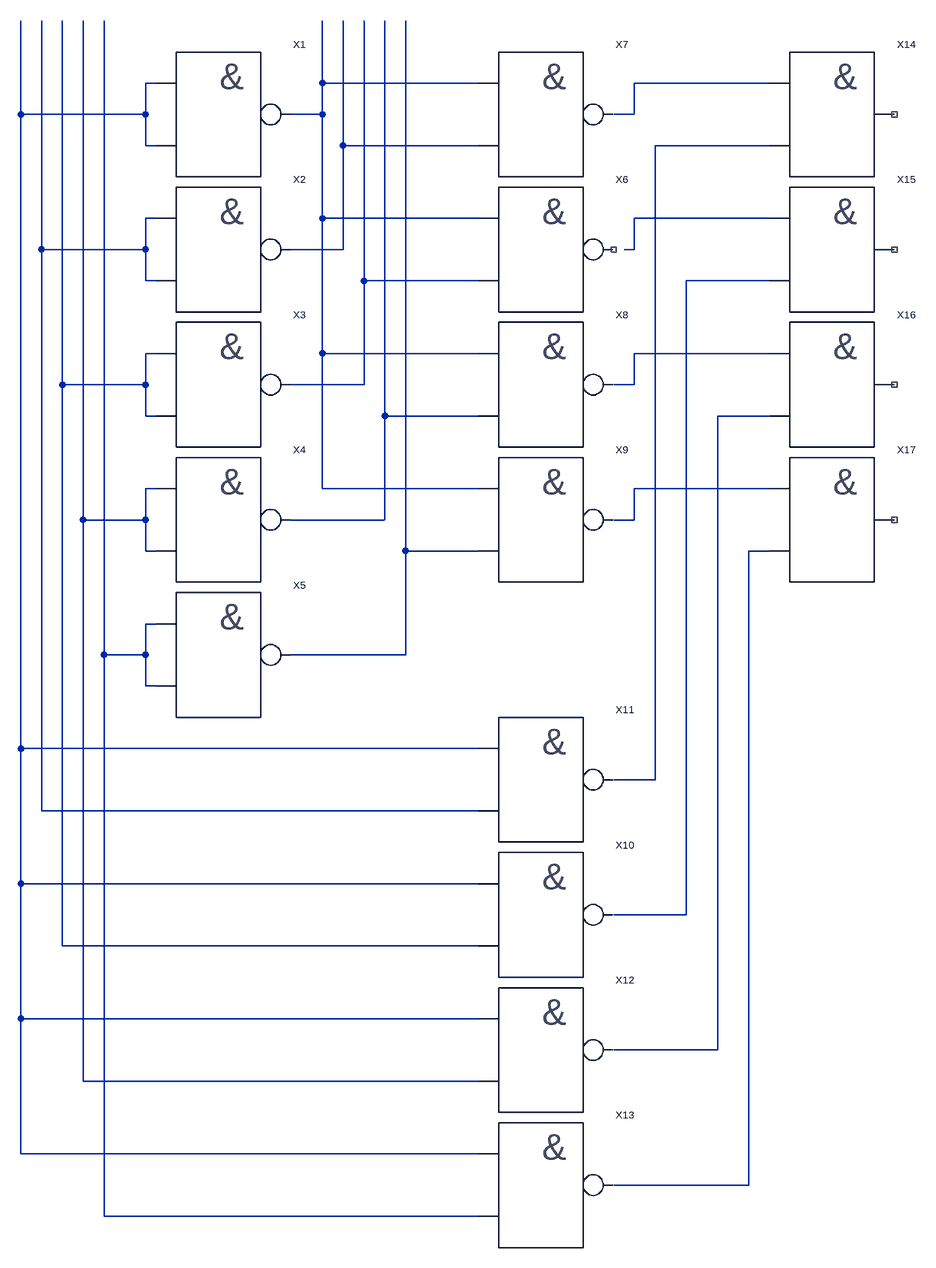
[diagram p0: schematic preobr.asc]
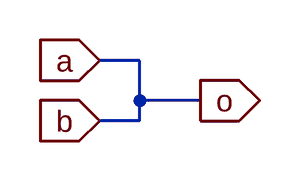
[diagram p1: sub-circuit and2.asc]
preobr.asc, the LTspice schematic file:
Version 4
SHEET 1 1400 1444
WIRE 256 -368 240 -368
WIRE 512 -368 512 -464
WIRE 752 -368 512 -368
WIRE 1200 -368 992 -368
WIRE 48 -320 48 -464
WIRE 240 -320 240 -368
WIRE 240 -320 48 -320
WIRE 512 -320 512 -368
WIRE 512 -320 464 -320
WIRE 992 -320 992 -368
WIRE 992 -320 960 -320
WIRE 240 -272 240 -320
WIRE 256 -272 240 -272
WIRE 544 -272 544 -464
WIRE 752 -272 544 -272
WIRE 1200 -272 1024 -272
WIRE 256 -160 240 -160
WIRE 512 -160 512 -320
WIRE 752 -160 512 -160
WIRE 1200 -160 992 -160
WIRE 80 -112 80 -464
WIRE 240 -112 240 -160
WIRE 240 -112 80 -112
WIRE 544 -112 544 -272
WIRE 544 -112 464 -112
WIRE 992 -112 992 -160
WIRE 992 -112 976 -112
WIRE 240 -64 240 -112
WIRE 256 -64 240 -64
WIRE 576 -64 576 -464
WIRE 752 -64 576 -64
WIRE 1200 -64 1072 -64
WIRE 256 48 240 48
WIRE 512 48 512 -160
WIRE 752 48 512 48
WIRE 1200 48 992 48
WIRE 112 96 112 -464
WIRE 240 96 240 48
WIRE 240 96 112 96
WIRE 576 96 576 -64
WIRE 576 96 464 96
WIRE 992 96 992 48
WIRE 992 96 960 96
WIRE 240 144 240 96
WIRE 256 144 240 144
WIRE 608 144 608 -464
WIRE 752 144 608 144
WIRE 1200 144 1120 144
WIRE 256 256 240 256
WIRE 512 256 512 48
WIRE 752 256 512 256
WIRE 1200 256 992 256
WIRE 144 304 144 -464
WIRE 240 304 240 256
WIRE 240 304 144 304
WIRE 608 304 608 144
WIRE 608 304 464 304
WIRE 992 304 992 256
WIRE 992 304 960 304
WIRE 240 352 240 304
WIRE 256 352 240 352
WIRE 640 352 640 -464
WIRE 752 352 640 352
WIRE 1200 352 1168 352
WIRE 256 464 240 464
WIRE 176 512 176 -464
WIRE 240 512 240 464
WIRE 240 512 176 512
WIRE 640 512 640 352
WIRE 640 512 464 512
WIRE 240 560 240 512
WIRE 256 560 240 560
WIRE 48 656 48 -320
WIRE 752 656 48 656
WIRE 1024 704 1024 -272
WIRE 1024 704 960 704
WIRE 80 752 80 -112
WIRE 752 752 80 752
WIRE 48 864 48 656
WIRE 752 864 48 864
WIRE 1072 912 1072 -64
WIRE 1072 912 960 912
WIRE 112 960 112 96
WIRE 752 960 112 960
WIRE 48 1072 48 864
WIRE 752 1072 48 1072
WIRE 1120 1120 1120 144
WIRE 1120 1120 960 1120
WIRE 144 1168 144 304
WIRE 752 1168 144 1168
WIRE 48 1280 48 1072
WIRE 752 1280 48 1280
WIRE 1168 1328 1168 352
WIRE 1168 1328 960 1328
WIRE 176 1376 176 512
WIRE 752 1376 176 1376
SYMBOL NAND2 352 -112 R0
SYMATTR InstName X2
SYMBOL NAND2 352 -320 R0
SYMATTR InstName X1
SYMBOL NAND2 352 96 R0
SYMATTR InstName X3
SYMBOL NAND2 352 304 R0
SYMATTR InstName X4
SYMBOL NAND2 352 512 R0
SYMATTR InstName X5
SYMBOL NAND2 848 -112 R0
SYMATTR InstName X6
SYMBOL NAND2 848 -320 R0
SYMATTR InstName X7
SYMBOL NAND2 848 96 R0
SYMATTR InstName X8
SYMBOL NAND2 848 304 R0
SYMATTR InstName X9
SYMBOL NAND2 848 912 R0
SYMATTR InstName X10
SYMBOL NAND2 848 704 R0
SYMATTR InstName X11
SYMBOL NAND2 848 1120 R0
SYMATTR InstName X12
SYMBOL NAND2 848 1328 R0
SYMATTR InstName X13
SYMBOL AND2 1296 -320 R0
SYMATTR InstName X14
SYMBOL AND2 1296 -112 R0
SYMATTR InstName X15
SYMBOL AND2 1296 96 R0
SYMATTR InstName X16
SYMBOL AND2 1296 304 R0
SYMATTR InstName X17

and2.asc, the sub-circuit schematic file:
Version 4
SHEET 1 880 680
WIRE 96 80 64 80
WIRE 96 112 96 80
WIRE 144 112 96 112
WIRE 96 128 96 112
WIRE 96 128 64 128
FLAG 64 80 a
IOPIN 64 80 In
FLAG 64 128 b
IOPIN 64 128 In
FLAG 144 112 o
IOPIN 144 112 Out

The netlist it stands for:
* preobr.asc
XX2 N006 N006 N004 NAND2  ; pins a b o
XX1 N001 N001 N002 NAND2  ; pins a b o
XX3 N010 N010 N008 NAND2  ; pins a b o
XX4 N014 N014 N012 NAND2  ; pins a b o
XX5 N018 N018 N016 NAND2  ; pins a b o
XX6 N002 N008 NC_01 NAND2  ; pins a b o
XX7 N002 N004 N003 NAND2  ; pins a b o
XX8 N002 N012 N011 NAND2  ; pins a b o
XX9 N002 N016 N015 NAND2  ; pins a b o
XX10 N001 N010 N009 NAND2  ; pins a b o
XX11 N001 N006 N005 NAND2  ; pins a b o
XX12 N001 N014 N013 NAND2  ; pins a b o
XX13 N001 N018 N017 NAND2  ; pins a b o
XX14 N003 N005 NC_02 and2
XX15 N007 N009 NC_03 and2
XX16 N011 N013 NC_04 and2
XX17 N015 N017 NC_05 and2

* block symbol definitions
.subckt and2 a b o
.ends and2

.backanno
.end